# Altium schematic sheet USB_Connectors.SchDoc: Dahlia Carrier Board
size A3; Organization: Toradex AG; Address1: Ebenaustrasse 10; Address2: Horw; Address3: 6048; Address4: Switzerland; DocumentNumber: 6; Revision: V1.1; SheetNumber: 6; SheetTotal: 21; PageSetup: Record=PageOptions|CenterHorizontal=True|CenterVertical=True|PrintScale=0.71|XCorrection=1.00|YCorrection=1.00|PrintKind=1|BorderSize=5000000|LeftOffset=0|BottomOffset=0|Orientation=2|PaperLength=1000|PaperWidth=1000|Scale=100|PaperSource=15|PrintQuality=600|MediaType=1|DitherType=10|PaperKind=A4|PrintScaleMode=1
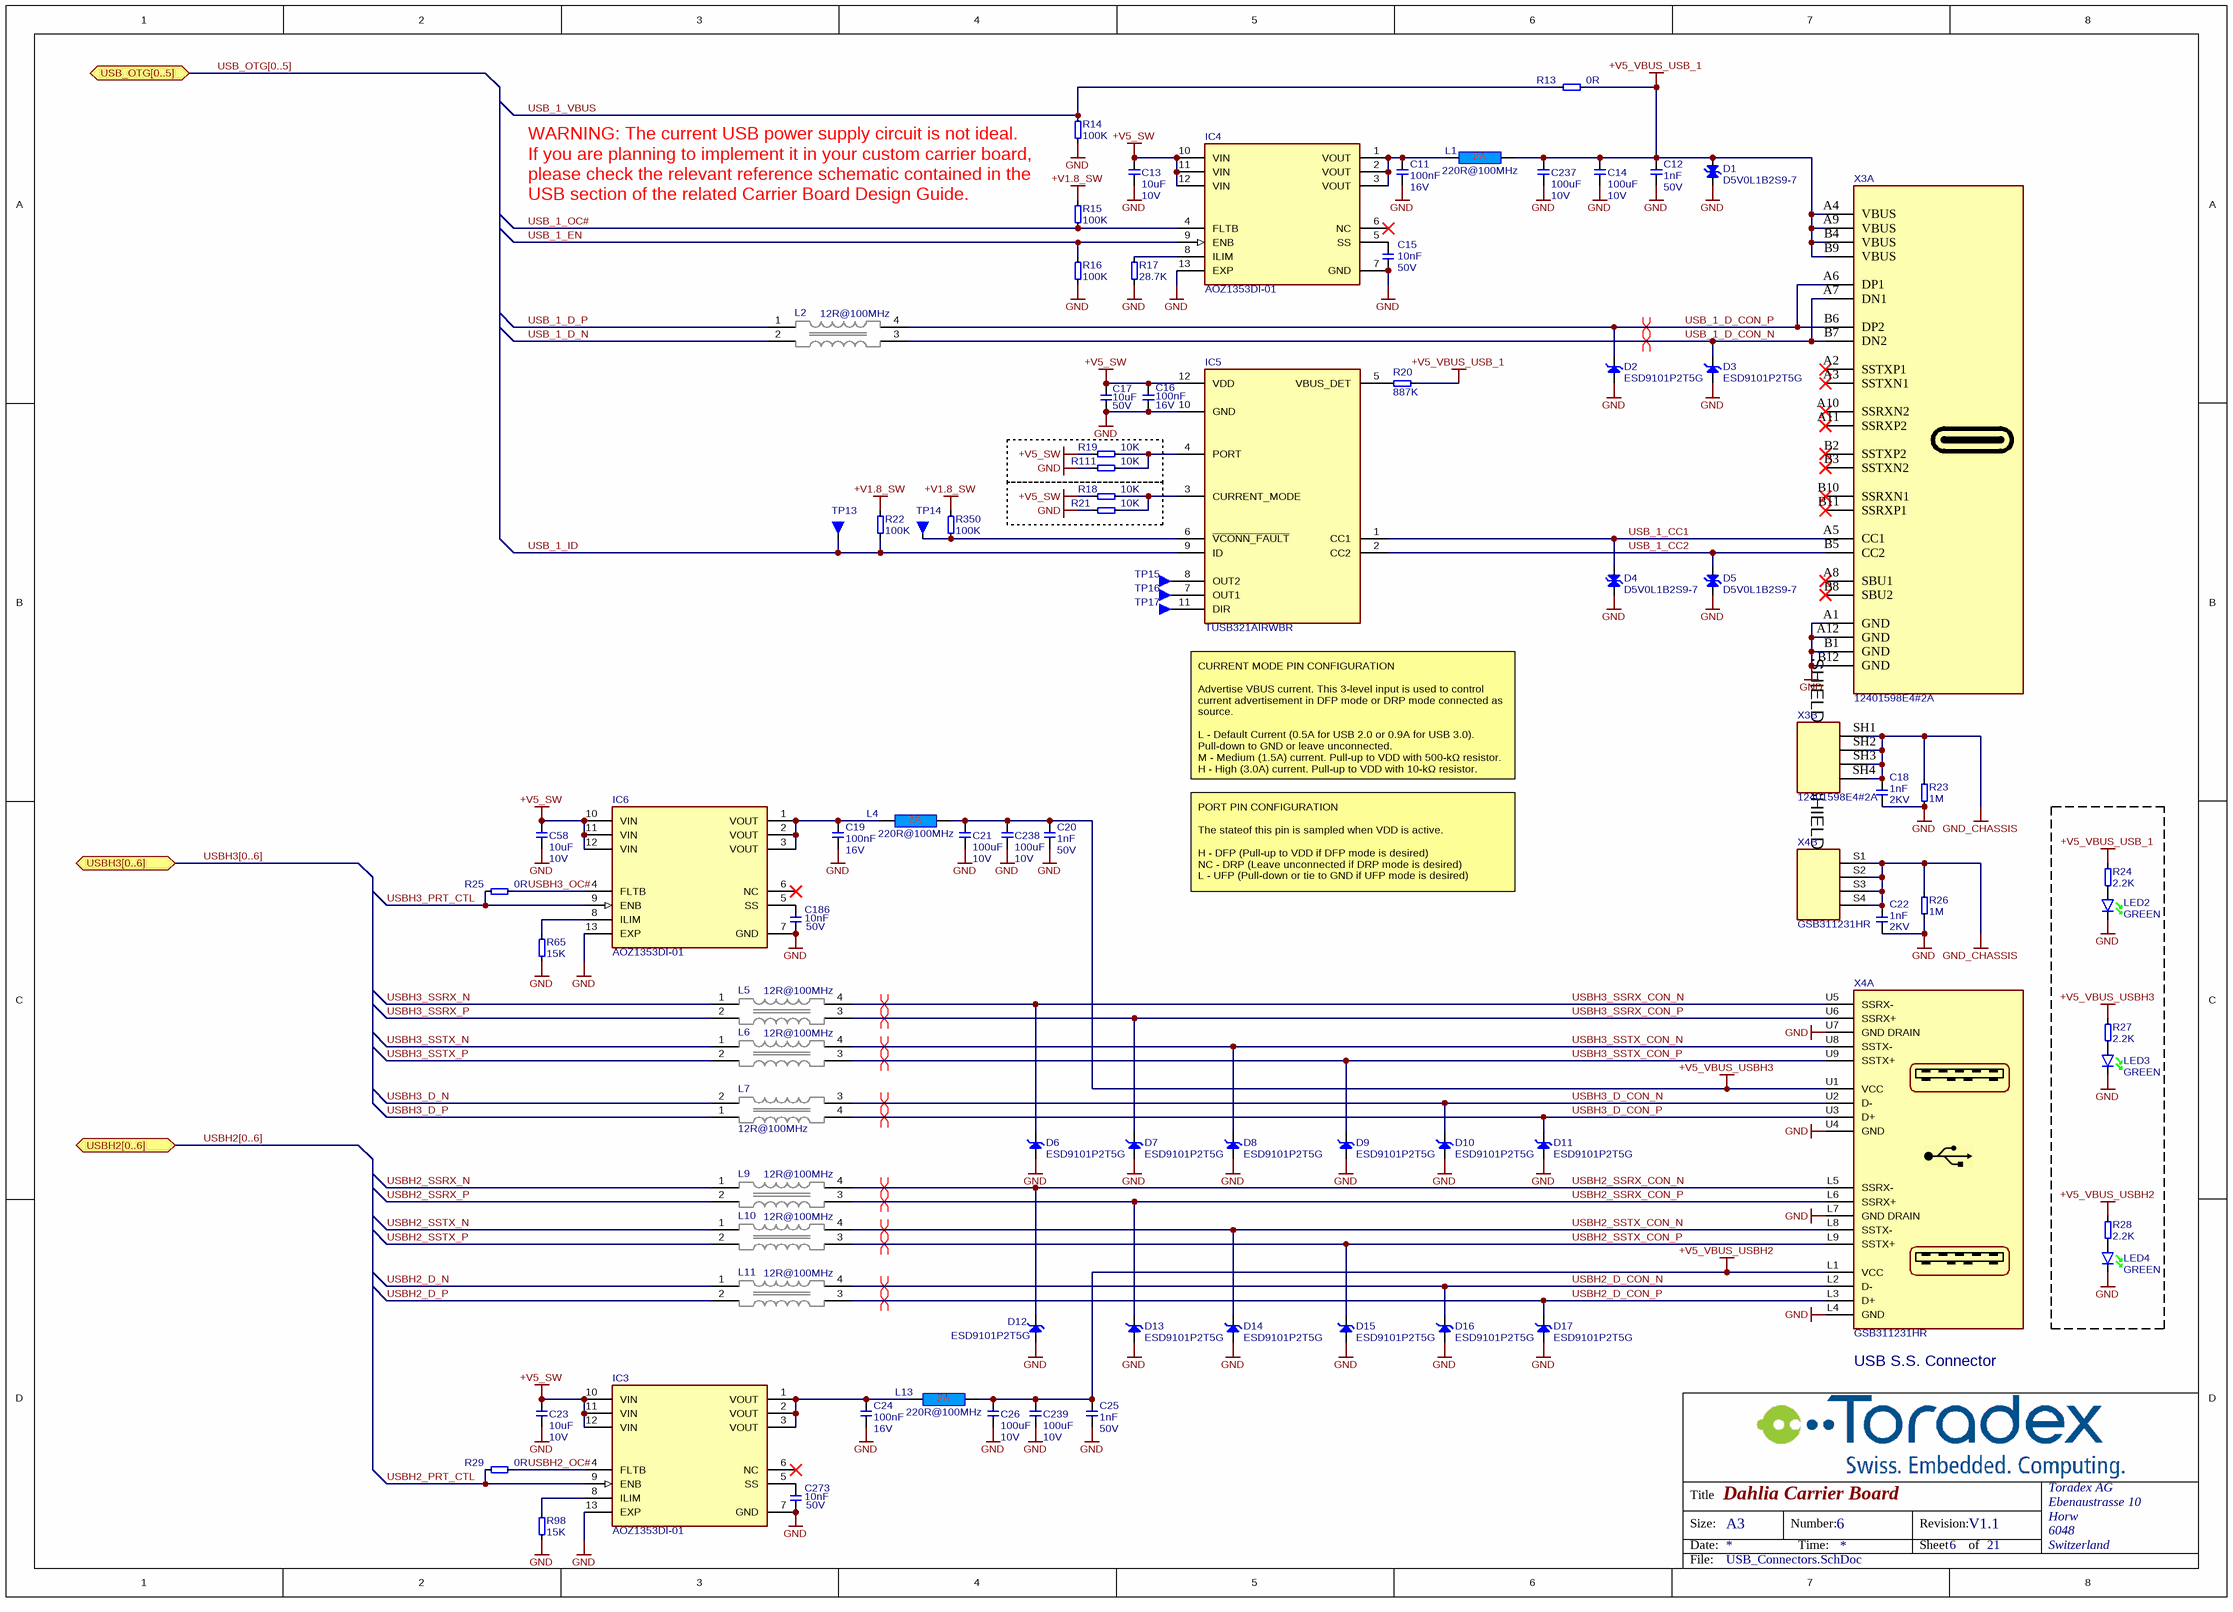
[diagram p0: USB_Connectors.SchDoc]

## Parts
C11  Rating: 16V  [CAPC1005X60N]  (hidden comment: 100nF)
C12  Rating: 50V  [CAPC1005X60N]  (hidden comment: 1nF)
C13  Rating: 10V  [T_CAPC0603X33N]  (hidden comment: 10uF)
C14  Rating: 10V  [T_CAPC1206X60N]  (hidden comment: 100uF)
C15  Rating: 50V  [CAPC1005X60N]  (hidden comment: 10nF)
C16  Rating: 16V  [CAPC1005X60N]  (hidden comment: 100nF)
C17  Rating: 50V  [T_CAPC1206X60N]  (hidden comment: 10uF)
C18  Rating: 2KV  [T_CAPC1206X180N]  (hidden comment: 1nF)
C19  Rating: 16V  [CAPC1005X60N]  (hidden comment: 100nF)
C20  Rating: 50V  [CAPC1005X60N]  (hidden comment: 1nF)
C21  Rating: 10V  [T_CAPC1206X60N]  (hidden comment: 100uF)
C22  Rating: 2KV  [T_CAPC1206X180N]  (hidden comment: 1nF)
C23  Rating: 10V  [T_CAPC0603X33N]  (hidden comment: 10uF)
C24  Rating: 16V  [CAPC1005X60N]  (hidden comment: 100nF)
C25  Rating: 50V  [CAPC1005X60N]  (hidden comment: 1nF)
C26  Rating: 10V  [T_CAPC1206X60N]  (hidden comment: 100uF)
C58  Rating: 10V  [T_CAPC0603X33N]  (hidden comment: 10uF)
C186  Rating: 50V  [CAPC1005X60N]  (hidden comment: 10nF)
C237  Rating: 10V  [T_CAPC1206X60N]  (hidden comment: 100uF)
C238  Rating: 10V  [T_CAPC1206X60N]  (hidden comment: 100uF)
C239  Rating: 10V  [T_CAPC1206X60N]  (hidden comment: 100uF)
C273  Rating: 50V  [CAPC1005X60N]  (hidden comment: 10nF)
D1  D5V0L1B2S9-7  [D-DIODES-SOD-923]
D2  ESD9101P2T5G  [SOD-923]
D3  ESD9101P2T5G  [SOD-923]
D4  D5V0L1B2S9-7  [D-DIODES-SOD-923]
D5  D5V0L1B2S9-7  [D-DIODES-SOD-923]
D6  ESD9101P2T5G  [SOD-923]
D7  ESD9101P2T5G  [SOD-923]
D8  ESD9101P2T5G  [SOD-923]
D9  ESD9101P2T5G  [SOD-923]
D10  ESD9101P2T5G  [SOD-923]
D11  ESD9101P2T5G  [SOD-923]
D12  ESD9101P2T5G  [SOD-923]
D13  ESD9101P2T5G  [SOD-923]
D14  ESD9101P2T5G  [SOD-923]
D15  ESD9101P2T5G  [SOD-923]
D16  ESD9101P2T5G  [SOD-923]
D17  ESD9101P2T5G  [SOD-923]
IC3  AOZ1353DI-01  [IC-A&O-AOZ1353DI-01]
IC4  AOZ1353DI-01  [IC-A&O-AOZ1353DI-01]
IC5  TUSB321AIRWBR  [IC-TI-TUSB321AIRWBR]
IC6  AOZ1353DI-01  [IC-A&O-AOZ1353DI-01]
L1  220R@100MHz  [INDC1608X95N]
L2  12R@100MHz  [T_Panasonic_EXC14CH120U]
L4  220R@100MHz  [INDC1608X95N]
L5  12R@100MHz  [T_Panasonic_EXC14CH120U]
L6  12R@100MHz  [T_Panasonic_EXC14CH120U]
L7  12R@100MHz  [T_Panasonic_EXC14CH120U]
L9  12R@100MHz  [T_Panasonic_EXC14CH120U]
L10  12R@100MHz  [T_Panasonic_EXC14CH120U]
L11  12R@100MHz  [T_Panasonic_EXC14CH120U]
L13  220R@100MHz  [INDC1608X95N]
LED2  Color: GREEN  [T_Liteon_LTST-C190GKT]  (hidden comment: LTST-C190GKT)
LED3  Color: GREEN  [T_Liteon_LTST-C190GKT]  (hidden comment: LTST-C190GKT)
LED4  Color: GREEN  [T_Liteon_LTST-C190GKT]  (hidden comment: LTST-C190GKT)
R13  0R  [T_RESC0603X30N]
R14  100K  [RESC1005X40N]
R15  100K  [RESC1005X40N]
R16  100K  [RESC1005X40N]
R17  28.7K  [T_RESC0603X30N]
R18  10K  [T_RESC0603X30N]
R19  10K  [T_RESC0603X30N]
R20  887K  [RESC1005X40N]
R21  10K  [T_RESC0603X30N]
R22  100K  [RESC1005X40N]
R23  1M  [RESC3216X75N]
R24  2.2K  [RESC1005X40N]
R25  0R  [T_RESC0603X30N]
R26  1M  [RESC3216X75N]
R27  2.2K  [RESC1005X40N]
R28  2.2K  [RESC1005X40N]
R29  0R  [T_RESC0603X30N]
R65  15K  [RESC1005X40N]
R98  15K  [RESC1005X40N]
R111  10K  [T_RESC0603X30N]
R350  100K  [RESC1005X40N]
TP13  Testpin-SMD  [T_TP-SMD]  (value not drawn)  (no BOM)
TP14  Testpin-SMD  [T_TP-SMD]  (value not drawn)  (no BOM)
TP15  Testpin-SMD  [T_TP-SMD]  (value not drawn)  (no BOM)
TP16  Testpin-SMD  [T_TP-SMD]  (value not drawn)  (no BOM)
TP17  Testpin-SMD  [T_TP-SMD]  (value not drawn)  (no BOM)
X3  12401598E4#2A  [CON-AMPHENOL-12401598E4#2A]  (parts A,B of 2)
X4  GSB311231HR  [T_AMPHENOL_ GSB311231HR]  (parts A,B of 2)

## Ports
USB_OTG[0..5] (bidir), USBH2[0..6] (bidir), USBH3[0..6] (bidir)

## Nets
+V1.8_SW: R15.2 R22.2 R350.1
+V5_SW: C13.2 C16.2 C17.2 C23.2 C58.2 IC3.10(VIN) IC3.11(VIN) IC3.12(VIN) IC4.10(VIN) IC4.11(VIN) IC4.12(VIN) IC5.12(VDD) IC6.10(VIN) IC6.11(VIN) IC6.12(VIN) R18.2 R19.2
+V5_VBUS_USB_1: C12.2 C14.2 C237.2 D1.2(A) L1.2 R13.2 R20.2 R24.1 X3.A4(VBUS) X3.A9(VBUS) X3.B4(VBUS) X3.B9(VBUS)
+V5_VBUS_USBH2: C25.2 C26.2 C239.2 L13.2 R28.1 X4.L1(VCC)
+V5_VBUS_USBH3: C20.2 C21.2 C238.2 L4.2 R27.1 X4.U1(VCC)
GND: C11.1 C12.1 C13.1 C14.1 C15.1 C16.1 C17.1 C18.1 C19.1 C20.1 C21.1 C22.1 C23.1 C24.1 C25.1 C26.1 C58.1 C186.1 C237.1 C238.1 C239.1 C273.1 D1.1(C) D2.2(A) D3.2(A) D4.1(C) D5.1(C) D6.2(A) D7.2(A) D8.2(A) D9.2(A) D10.2(A) D11.2(A) D12.2(A) D13.2(A) D14.2(A) D15.2(A) D16.2(A) D17.2(A) IC3.7(GND) IC3.13(EXP) IC4.7(GND) IC4.13(EXP) IC5.10(GND) IC6.7(GND) IC6.13(EXP) LED2.K LED3.K LED4.K R14.2 R16.1 R17.1 R21.2 R23.1 R26.1 R65.1 R98.1 R111.2 X3.A1(GND) X3.A12(GND) X3.B1(GND) X3.B12(GND) X4.L4(GND) X4.L7(GND_DRAIN) X4.U4(GND) X4.U7(GND_DRAIN)
GND_CHASSIS: C18.2 C22.2 R23.2 R26.2 X3.SH1(SHIELD) X3.SH2(SHIELD) X3.SH3(SHIELD) X3.SH4(SHIELD) X4.S1(SHIELD) X4.S2(SHIELD) X4.S3(SHIELD) X4.S4(SHIELD)
USB_1_CC1: D4.2(A) IC5.1(CC1) X3.A5(CC1)
USB_1_CC2: D5.2(A) IC5.2(CC2) X3.B5(CC2)
USB_1_D_CON_N: D3.1(C) L2.3 X3.A7(DN1) X3.B7(DN2)
USB_1_D_CON_P: D2.1(C) L2.4 X3.A6(DP1) X3.B6(DP2)
USB_1_D_N: L2.2
USB_1_D_P: L2.1
USB_1_EN: IC4.9(ENB) R16.2
USB_1_ID: IC5.9(ID) R22.1 TP13.1
USB_1_OC#: IC4.4(FLTB) R15.1
USB_1_VBUS: R13.1 R14.1
USBH2_D_CON_N: D16.1(C) L11.4 X4.L2(D-)
USBH2_D_CON_P: D17.1(C) L11.3 X4.L3(D+)
USBH2_D_N: L11.1
USBH2_D_P: L11.2
USBH2_OC#: IC3.4(FLTB) R29.2
USBH2_PRT_CTL: IC3.9(ENB) R29.1
USBH2_SSRX_CON_N: D12.1(C) L9.4 X4.L5(SSRX-)
USBH2_SSRX_CON_P: D13.1(C) L9.3 X4.L6(SSRX+)
USBH2_SSRX_N: L9.1
USBH2_SSRX_P: L9.2
USBH2_SSTX_CON_N: D14.1(C) L10.4 X4.L8(SSTX-)
USBH2_SSTX_CON_P: D15.1(C) L10.3 X4.L9(SSTX+)
USBH2_SSTX_N: L10.1
USBH2_SSTX_P: L10.2
USBH3_D_CON_N: D10.1(C) L7.3 X4.U2(D-)
USBH3_D_CON_P: D11.1(C) L7.4 X4.U3(D+)
USBH3_D_N: L7.2
USBH3_D_P: L7.1
USBH3_OC#: IC6.4(FLTB) R25.2
USBH3_PRT_CTL: IC6.9(ENB) R25.1
USBH3_SSRX_CON_N: D6.1(C) L5.4 X4.U5(SSRX-)
USBH3_SSRX_CON_P: D7.1(C) L5.3 X4.U6(SSRX+)
USBH3_SSRX_N: L5.1
USBH3_SSRX_P: L5.2
USBH3_SSTX_CON_N: D8.1(C) L6.4 X4.U8(SSTX-)
USBH3_SSTX_CON_P: D9.1(C) L6.3 X4.U9(SSTX+)
USBH3_SSTX_N: L6.1
USBH3_SSTX_P: L6.2
NetC11_2: C11.2 IC4.1(VOUT) IC4.2(VOUT) IC4.3(VOUT) L1.1
NetC15_2: C15.2 IC4.5(SS)
NetC19_2: C19.2 IC6.1(VOUT) IC6.2(VOUT) IC6.3(VOUT) L4.1
NetC24_2: C24.2 IC3.1(VOUT) IC3.2(VOUT) IC3.3(VOUT) L13.1
NetC186_2: C186.2 IC6.5(SS)
NetC273_2: C273.2 IC3.5(SS)
NetIC3_8: IC3.8(ILIM) R98.2
NetIC4_8: IC4.8(ILIM) R17.2
NetIC5_3: IC5.3(CURRENT_MODE) R18.1 R21.1
NetIC5_4: IC5.4(PORT) R19.1 R111.1
NetIC5_5: IC5.5(VBUS_DET) R20.1
NetIC5_6: IC5.6(~{VCONN_FAULT}) R350.2 TP14.1
NetIC5_7: IC5.7(OUT1) TP16.1
NetIC5_8: IC5.8(OUT2) TP15.1
NetIC5_11: IC5.11(DIR) TP17.1
NetIC6_8: IC6.8(ILIM) R65.2
NetLED2_A: LED2.A R24.2
NetLED3_A: LED3.A R27.2
NetLED4_A: LED4.A R28.2

Not connected (* = marked no-connect by the designer): IC3 6(NC)*; IC4 6(NC)*; IC6 6(NC)*; X3 A2(SSTXP1)* A3(SSTXN1)* A8(SBU1)* A10(SSRXN2)* A11(SSRXP2)* B2(SSTXP2)* B3(SSTXN2)* B8(SBU2)* B10(SSRXN1)* B11(SSRXP1)*

## Buses and harness runs
bus USB_OTG[0..5] = port USB_OTG[0..5]
bus USBH2[0..6] = port USBH2[0..6]
bus USBH3[0..6] = port USBH3[0..6]

## Layout directives
differential pair; differential pair class USB: USB_1_D_CON_N, USB_1_D_CON_P, USBH2_D_CON_N, USBH2_D_CON_P, USBH2_SSRX_CON_N, USBH2_SSRX_CON_P, USBH2_SSTX_CON_N, USBH2_SSTX_CON_P, USBH3_D_CON_N, USBH3_D_CON_P, USBH3_SSRX_CON_N, USBH3_SSRX_CON_P, USBH3_SSTX_CON_N, USBH3_SSTX_CON_P

## Notes on the sheet
- WARNING: The current USB power supply circuit is not ideal.
  If you are planning to implement it in your custom carrier board, please check the relevant reference schematic contained in the USB section of the related Carrier Board Design Guide.
- CURRENT MODE PIN CONFIGURATION
  Advertise VBUS current. This 3-level input is used to control current advertisement in DFP mode or DRP mode connected as source.
  L - Default Current (0.5A for USB 2.0 or 0.9A for USB 3.0). Pull-down to GND or leave unconnected.
  M - Medium (1.5A) current. Pull-up to VDD with 500-kΩ resistor.
  H - High (3.0A) current. Pull-up to VDD with 10-kΩ resistor.
- PORT PIN CONFIGURATION
  The stateof this pin is sampled when VDD is active.
  H - DFP (Pull-up to VDD if DFP mode is desired)
  NC - DRP (Leave unconnected if DRP mode is desired)
  L - UFP (Pull-down or tie to GND if UFP mode is desired)
- (near X4) USB S.S. Connector
- Title
- Size:
- Date:
- A3
- Number:
- Time:
- Revision:
- Sheet
- of
- File:

## Library data of the parts
C11 C16 C19 C24 = C-X7R-100nF-16V-10%-0402: Capacitor Ceramic X7R 100nF 16V 10% 0402; Tolerance: 10%; Type: X7R; Value: 100nF
C12 C20 C25 = C-X7R-1nF-50V-10%-0402: Capacitor Ceramic X7R 1nF 50V 10% 0402; Tolerance: 10%; Type: X7R; Value: 1nF
C13 C23 C58 = C-X5R-10uF-10V-20%-0603: Capacitor Ceramic X5R 10uF 10V 20% 0603; Tolerance: 20%; Type: X5R; Value: 10uF
C14 C21 C26 C237-C239 = C-X5R-100uF-10V-20%-1206: Capacitor Ceramic X5R 100uF 10V 20% 1206; Tolerance: 20%; Type: X5R; Value: 100uF
C15 C186 C273 = C-X7R-10nF-50V-10%-0402: Capacitor Ceramic X7R 10nF 50V 10% 0402; Tolerance: 10%; Type: X7R; Value: 10nF
C17 = C-X5R-10uF-50V-20%-1206: Capacitor Ceramic X5R 10uF 50V 20% 1206; Tolerance: 20%; Type: X5R; Value: 10uF
C18 C22 = C-X7R-1nF-2KV-10%-1206: Capacitor Ceramic X7R 1nF 2KV 10% 1206; Tolerance: 10%; Type: X7R; Value: 1nF
D1 D4 D5 = D-Diodes-D5V0L1B2S9-7: BIDIRECTIONAL TVS DIODE 5V  SOD923; Manufacturer Name: Diodes; Manufacturer Part No.: D5V0L1B2S9-7
D2 D3 D6-D17 = D-OnSemi-ESD9101P2T5G: ESD Protection Diode; Manufacturer Name: OnSemi; Manufacturer Part No.: ESD9101P2T5G
IC3 IC4 IC6 = IC-A&O-AOZ1353DI-01: 5V/3A  Smart Current Limited Load Switch with True Reverse Current Blocking; Manufacturer Name: Alpha and Omega; Manufacturer Part No.: AOZ1353DI-01
IC5 = IC-TI-TUSB321AIRWBR: USB Type-C Configuration Channel Logic and Port Control with VCON; Manufacturer Name: Texas Instruments; Manufacturer Part No.: TUSB321AIRWBR
L1 L4 L13 = L-220R@100MHz-2A-25%-0603: 220R@100MHz 2A EMI FILTER; Tolerance: 25%; Rating: 2A; Value: 220R@100MHz
L2 L5-L7 L9-L11 = L-Panasonic-EXC14CH120U-12R@100MHz-1000mA-25%: Common Mode Choke High Speed 12R 100mA; Tolerance: 25%; Rating: 100mA; Manufacturer Name: Panasonic; Manufacturer Part No.: EXC14CH120U; Value: 12R@100MHz
LED2-LED4 = LED-LiteOn-LTST-C190GKT: LED green Lite-ON LTST-C190GKT; Manufacturer Name: Lite-ON; Manufacturer Part No.: LTST-C190GKT
R13 R25 R29 = R-0R-63mW-1%-0603: Resistor 0 ohm 63mW 1% 0603; Rating: 63mW; Tolerance: 1%; Value: 0R
R14-R16 R22 R350 = R-100K-63mW-5%-0402: Resistor 100 Kohm 63mW 5% 0402; Rating: 63mW; Tolerance: 5%; Value: 100K
R17 = R-28.7K-63mW-1%-0603: Resistor 28.7 Kohm 63mW 1% 0603; Rating: 63mW; Tolerance: 1%; Value: 28.7K
R18 R19 R21 R111 = R-10K-63mW-5%-0603: Resistor 10 Kohm 63mW 5% 0603; Rating: 63mW; Tolerance: 5%; Value: 10K
R20 = R-887K-63mW-1%-0402: Resistor 887 Kohm 63mW 1% 0402; Rating: 63mW; Tolerance: 1%; Value: 887K
R23 R26 = R-1M-250mW-5%-1206: Resistor 1 Mohm 250mW 5% 1206; Rating: 250mW; Tolerance: 5%; Value: 1M
R24 R27 R28 = R-2.2K-63mW-5%-0402: Resistor 2.2 Kohm 63mW 5% 0402; Value: 2.2KR; Rating: 63mW; Tolerance: 5%
R65 R98 = R-15KR-63mW-1%-0402: Resistor 15 Kohm 63mW 1% 0402; Value: 15KR; Rating: 63mW; Tolerance: 1%
TP13-TP17 = Testpin-SMD: Testpin SMD
X3 = CON-Amphenol-12401598E4#2A: USB 3.1 Gen 2, Input Output Connectors, USB type C, Receptacle, Top mount, dual-row SMT, 1.6mmPCB; No. of ways: 24; Manufacturer Name: Amphenol; Manufacturer Part No.: 12401598E4#2A
X4 = CON-Amphenol-GSB311231HR: USB 3.0 double row, Type A; No. of ways: 18; Manufacturer Name: Amphenol; Manufacturer Part No.: GSB311231HR